# EAGLE design SMD (EAGLE 8.0.1)
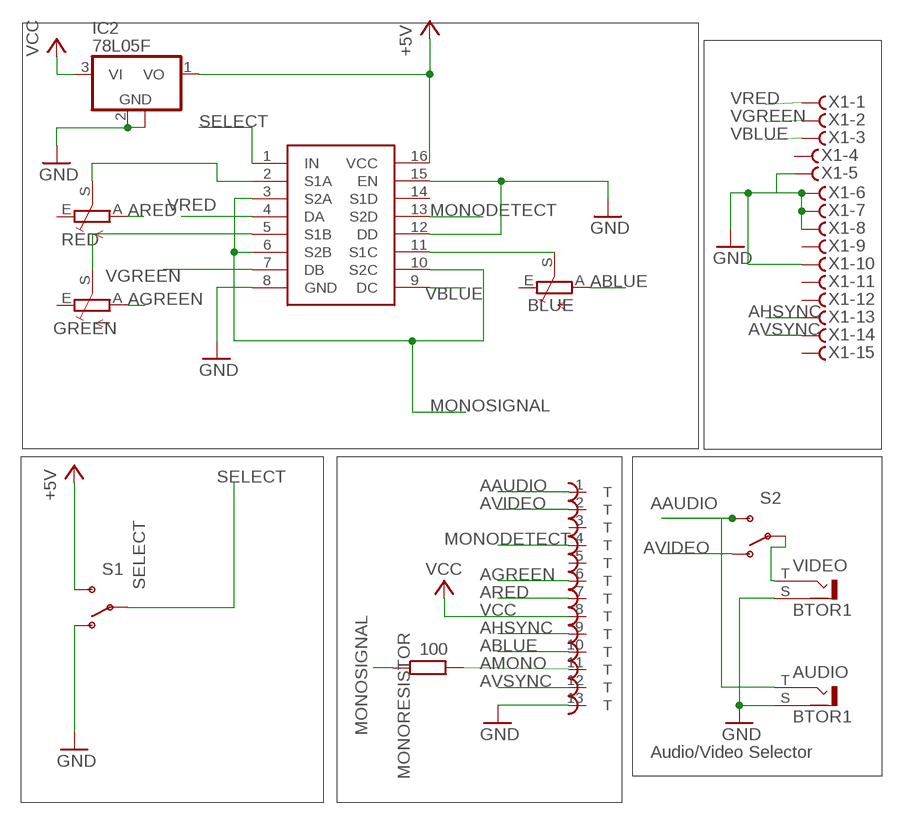
[diagram p0: schematic, sheet 1]

## Parts
ATARIOUT  DIN13T  [ADADS]
AUDIO  BTOR1  [BTOR1]
BLUE  TRIM_EU-CA6H  [CA6H]
GREEN  TRIM_EU-CA6H  [CA6H]
IC2  78L05F  [SOT89]
MONORESISTOR  100  R-EU_R1206  [R1206]
RED  TRIM_EU-CA6H  [CA6H]
S1  SWITCH-SPDT-SMD-A  [SWITCH-SPST-SMD-A]
S2  SWITCH-SPDT-SMD-A  [SWITCH-SPST-SMD-A]
TS5V330  V330  [SOIC16N]
VIDEO  BTOR1  [BTOR1]
X1  F15HDVS  [HDF15V]

## Nets
+5V: IC2.1(VO) S1.3(S) TS5V330.16(VCC)
A/V-PIN: S2.2(P) VIDEO.T
AAUDIO: ATARIOUT.1 AUDIO.T S2.3(S)
ABLUE: ATARIOUT.10 BLUE.A
AGREEN: ATARIOUT.6 GREEN.A
AHSYNC: ATARIOUT.9 X1.13
AMONO: ATARIOUT.11 MONORESISTOR.2
ARED: ATARIOUT.7 RED.A
AVIDEO: ATARIOUT.2 S2.1(O)
AVSYNC: ATARIOUT.12 X1.14
BOUT: BLUE.S TS5V330.11(S1C)
GND: ATARIOUT.13 AUDIO.S IC2.2(GND) IC2.2@1(GND) S1.1(O) TS5V330.8(GND) TS5V330.12(DD) TS5V330.15(EN) VIDEO.S X1.5 X1.6 X1.7 X1.8 X1.10
GOUT: GREEN.S TS5V330.5(S1B)
MONODETECT: ATARIOUT.4 TS5V330.13(S2D)
MONOSIGNAL: MONORESISTOR.1 TS5V330.3(S2A) TS5V330.6(S2B) TS5V330.10(S2C)
ROUT: RED.S TS5V330.2(S1A)
SELECT: S1.2(P) TS5V330.1(IN)
VBLUE: TS5V330.9(DC) X1.3
VCC: ATARIOUT.8 IC2.3(VI)
VGREEN: TS5V330.7(DB) X1.2
VRED: TS5V330.4(DA) X1.1
Unconnected: ATARIOUT.3 ATARIOUT.5 AUDIO.S@1 AUDIO.S@2 AUDIO.S@3 BLUE.E GREEN.E RED.E TS5V330.14(S1D) VIDEO.S@1 VIDEO.S@2 VIDEO.S@3 X1.4 X1.9 X1.11 X1.12 X1.15

## Notes on the sheet
- Audio/Video Selector

## Library data of the parts
ATARIOUT = ube:DIN13
AUDIO VIDEO = con-lumberg:BTOR1: RCA connectors according to JEITA RC-5231 Cinch RCA-Einbaukupplung nach JEITA RC-5231, stehende Ausführung Source: http://www.lumberg.de/Produkte/PDFs/BTOR1.pdf; OC_FARNELL: 1217030; OC_NEWARK: unknown
BLUE GREEN RED = pot:TRIM_EU-: POTENTIOMETER
IC2 = linear:78L*: POSITOIV-VOLTAGE REGULATORS Output up to 100 mA Source: Datasheet <http://focus.ti.com/lit/ds/symlink/ua78l05.pdf>
MONORESISTOR = rcl:R-EU_: RESISTOR, European symbol
S1 S2 = SparkFun-Electromechanical:SWITCH-SPDT: SPDT Switch Simple slide switch, Spark Fun Electronics SKU : COM-00102 DPDT SMT slide switch, AYZ0202, SWCH-08179; PROD_ID: SWCH-10651
TS5V330 = ube:V330
X1 = con-subd:F15?S: SUB-D; OC_FARNELL: unknown; OC_NEWARK: unknown

## Net classes
0 default: width 0.254 mm

## Board
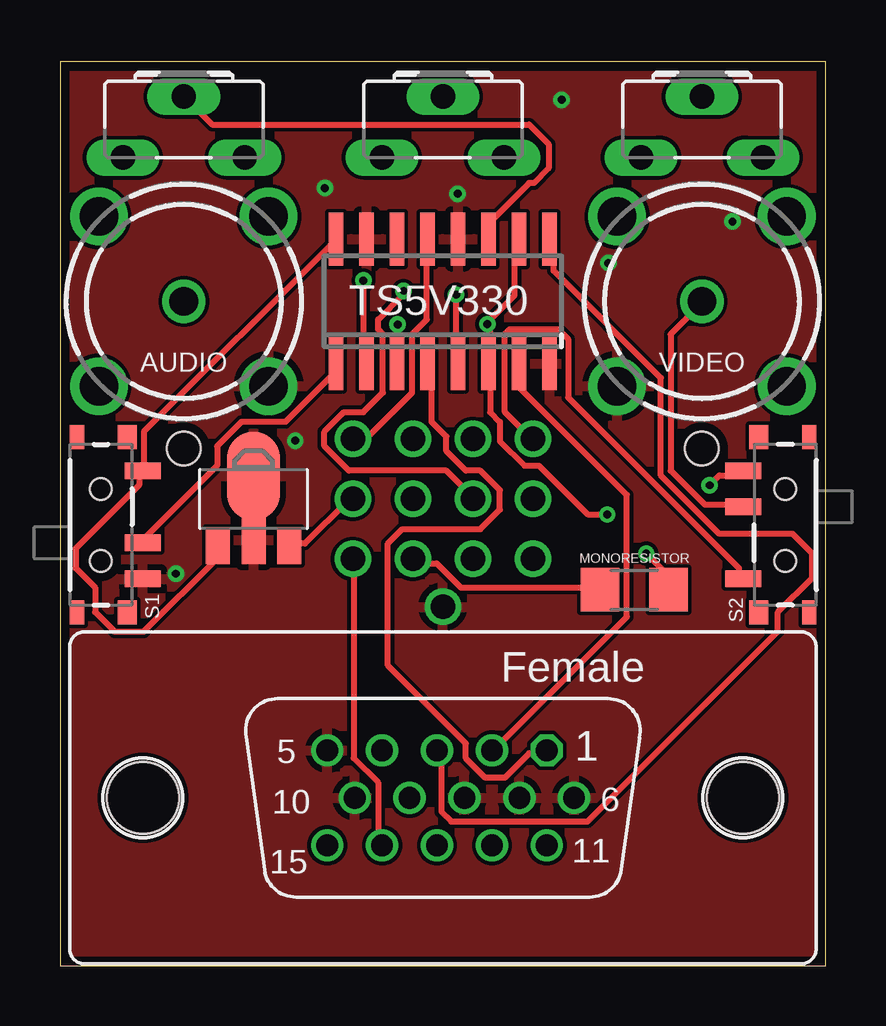
[diagram p1: board, top side]
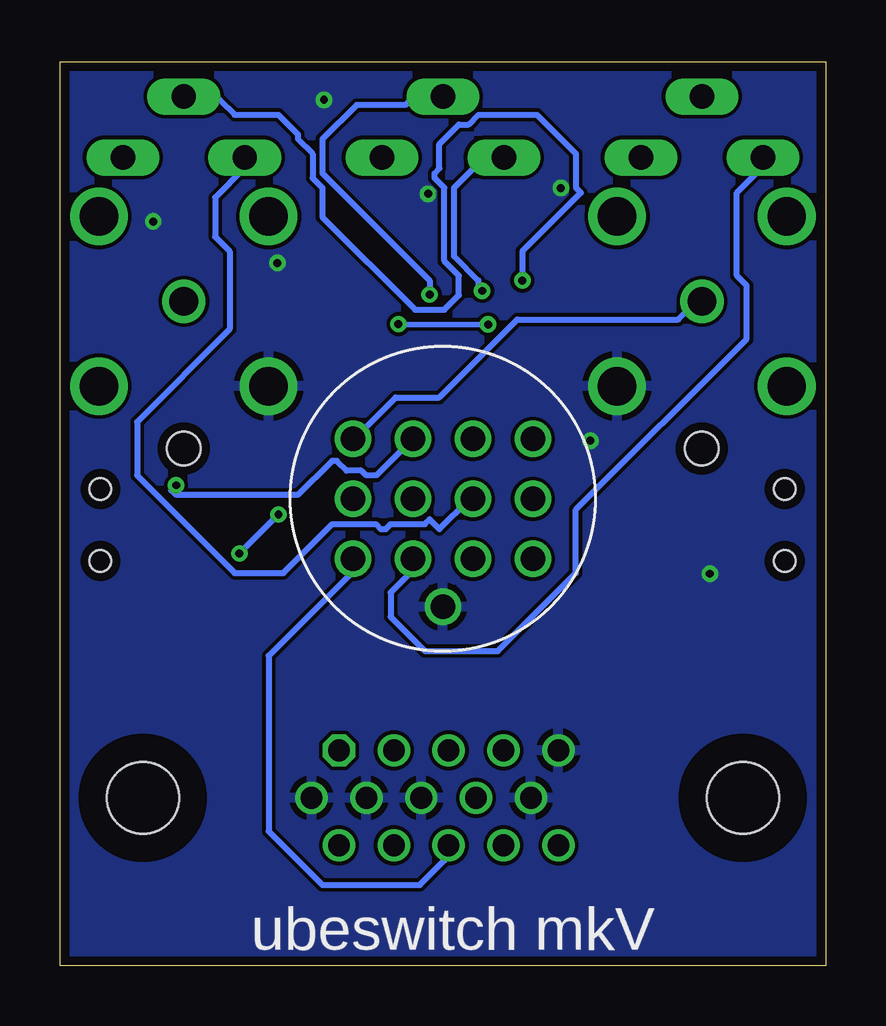
[diagram p2: board, bottom side, seen from below]

Size 31.9 x 37.7 mm. Coordinates in mm from the lower left corner, seen from the top.
Outline: 0,0 31.9,0 31.9,37.7 0,37.7 0,0
Copper layers (1*16): Top 0.0356mm / dielectric 1.5011mm / Bottom 0.0356mm
Design rules "PCBs_io": minimum track width 6mil, minimum drill 13mil, track to track 6mil, track to pad 6mil, pad to pad 6mil, via to via 6mil, smd to smd 6mil, copper to edge 15mil, drill to drill 6mil, minimum pad ring 7mil, minimum via ring 7mil, stop-mask expansion 3mil, vias tented up to drill 0mil, thermal gap 10mil
Holes 1.4 mm at 5.16,21.56 26.75,21.56

### Footprints (pad centres in the part's own frame; a part is rotated, then mirrored left to right if it is on the bottom)
ADADS = drill 1.016: 1 -3.75,2.5; 2 -1.25,2.5; 3 1.25,2.5; 4 3.75,2.5; 5 -3.75,0; 6 -1.25,0; 7 1.25,0; 8 3.75,0; 9 -3.75,-2.5; 10 -1.25,-2.5; 11 1.25,-2.5; 12 3.75,-2.5; 13 0,-4.5
BTOR1 = drill 1.6 pad 2.2: S -5,0; S@1 0,5; S@2 5,0; S@3 0,-5 | drill 1.2 pad 1.6: T 0,0
CA6H = drill 1.016 long: A -2.54,0; E 2.54,0; S 0,2.54
SOT89 = smd 1 x 1.5: 1 -1.499,-1.981; 3 1.499,-1.981 | smd 1 x 2: 2 0,-1.727 | smd 2.2 x 3.7: 2@1 0,0.94
R1206 = smd 1.6 x 1.803: 1 -1.422,0; 2 1.422,0
SWITCH-SPST-SMD-A = smd 0.7 x 1.5: 1 -2.25,-1.75; 2 -0.75,-1.75; 3 2.25,-1.75 | smd 1 x 0.6: GND1 -3.65,1; GND3 3.65,1 | smd 1 x 0.8: GND2 -3.65,-1.1; GND4 3.65,-1.1 | hole 0.9: -1.5,0; 1.5,0
SOIC16N = smd 0.6 x 2.2: 1 -4.445,-2.6; 2 -3.175,-2.6; 3 -1.905,-2.6; 4 -0.635,-2.6; 5 0.635,-2.6; 6 1.905,-2.6; 7 3.175,-2.6; 8 4.445,-2.6; 9 4.445,2.6; 10 3.175,2.6; 11 1.905,2.6; 12 0.635,2.6; 13 -0.635,2.6; 14 -1.905,2.6; 15 -3.175,2.6; 16 -4.445,2.6
HDF15V = drill 0.9 octagon: 1 4.329,1.98 | drill 0.9: 2 2.043,1.98; 3 -0.243,1.98; 4 -2.529,1.98; 5 -4.815,1.98; 6 5.472,0; 7 3.186,0; 8 0.9,0; 9 -1.386,0; 10 -3.672,0; 11 4.329,-1.98; 12 2.043,-1.98; 13 -0.243,-1.98; 14 -2.529,-1.98; 15 -4.815,-1.98 | hole 3: -12.5,0; 12.5,0

### Placement (x,y rotation side)
ATARIOUT  15.95,19.47 0 bottom
AUDIO  5.16,27.7 135 top
BLUE  5.16,33.7 0 top
GREEN  15.95,33.7 0 top
IC2  8.06,19.48 0 top
MONORESISTOR  23.93,15.68 180 top
RED  26.75,33.7 0 top
S1  1.71,18.38 90 top
S2  30.22,18.38 270 top
TS5V330  15.95,27.7 0 top
VIDEO  26.75,27.7 45 top
X1  15.95,7 0 top

### Tracks (layer width: path | path; a pad name or v marks a point on that pad's centre or on a via)
+5V
  Top 0.254: TS5V330.16 11.42,30.2 3.5,22.27 3.5,20.65 S1.3 3.29,20.44 3.29,20.04 0.65,17.39 0.65,16.58 1.47,15.77 1.47,14.75 2.28,13.94 3.5,13.94 6.55,16.99 6.55,17.39 IC2.1
A/V-PIN
  Top 0.254: S2.2 28.29,19.22 26.87,19.22 25.44,20.65 25.44,26.34 26.66,27.55 VIDEO.T
AAUDIO
  Top 0.254: S2.3 28.29,16.18 28.29,16.58 21.18,23.69 21.18,26.13 20.77,26.54 18.74,26.54 18.53,26.34 18.53,23.08 19.55,22.07 ATARIOUT.1
  Bottom 0.254: AUDIO.T 5.33,27.55 5.53,27.55 6.14,26.95 12.85,26.95 16.1,23.69 17.93,23.69 19.55,22.07 ATARIOUT.1
ABLUE
  Bottom 0.254: BLUE.A 2.69,33.65 2.69,33.24 3.7,32.23 3.7,28.77 3.29,28.37 3.29,26.13 10.41,19.02 10.41,16.38 13.66,13.13 16.71,13.13 18.13,14.55 18.13,15.57 17.32,16.38 17.32,16.79 ATARIOUT.10
AGREEN  (via drill 0.33)
  Top 0.254: ATARIOUT.6 17.11,19.63 16.1,20.65 12.03,20.65 11.02,21.66 11.02,22.27 11.83,23.08 12.64,23.08 13.45,23.9 13.45,26.34 13.25,26.54 13.25,26.95 14.27,27.96 v14.32,28.14
  Bottom 0.254: GREEN.A 13.45,33.65 14.27,33.65 15.49,32.43 15.49,29.59 14.47,28.57 14.47,28.16 v14.32,28.14
AHSYNC
  Bottom 0.254: X1.13 15.89,5 15.89,4.39 16.91,3.37 20.97,3.37 23.21,5.61 23.21,12.92 19.75,16.38 19.75,16.79 ATARIOUT.9
AMONO
  Top 0.254: MONORESISTOR.2 22.4,15.77 16.71,15.77 15.69,16.79 14.88,16.79 ATARIOUT.11
ARED
  Bottom 0.254: ATARIOUT.7 14.88,19.43 16.1,18.21 16.5,18.61 16.71,18.41 18.13,18.41 18.33,18.21 18.53,18.21 18.74,18.41 20.57,18.41 22.6,16.38 24.63,16.38 28.69,20.44 28.69,22.68 24.83,26.54 24.83,29.79 25.44,30.4 25.44,32.03 24.22,33.24 24.22,33.65 RED.A
AVIDEO  (via drill 0.33)
  Top 0.254: v27.07,20.04 27.48,20.44 28.29,20.44 S2.1
  Bottom 0.254: v27.07,20.04 27.27,19.83 27.07,19.63 21.99,19.63 20.57,21.05 20.36,21.05 19.96,20.65 19.35,20.65 19.14,20.44 18.74,20.44 17.32,21.86 ATARIOUT.2
AVSYNC
  Top 0.254: X1.14 13.25,5.2 13.25,7.64 12.24,8.66 12.24,16.79 ATARIOUT.12
BOUT
  Top 0.254: TS5V330.11 17.93,30.4 17.93,31.01 19.55,32.63 19.75,32.63 20.36,33.24 20.36,34.26 19.55,35.07 6.34,35.07 5.33,36.09 BLUE.S
GND  (via drill 0.33)
  Top 0.254: IC2.2@1 8.17,20.24 8.17,20.21
  Bottom 0.254: 23.82,24.71 VIDEO.S
  other vias: 4.83,16.35 16.56,32.18 11.03,32.43 9.8,21.89 28.02,31.03 22.85,29.3 20.9,36.1
  pour Bottom: 0.3,39.34 32.05,39.34 32.05,-0.03 0.3,-0.03
  pour Top: 0.3,-0.03 0.3,38.07 32.05,38.07 32.05,-0.03
GOUT  (via drill 0.33)
  Top 0.254: v16.5,27.98 16.5,25.12 TS5V330.5
  Bottom 0.254: GREEN.S 16.1,36.09 17.32,36.09 17.52,35.89 19.55,35.89 20.97,34.46 20.97,33.04 16.5,28.57 v16.5,27.98
MONODETECT
  Top 0.254: TS5V330.13 15.28,30.2 15.28,26.95 14.67,26.34 14.67,23.9 12.85,22.07 12.24,22.07 ATARIOUT.4
MONOSIGNAL  (via drill 0.33)
  Top 0.254: v24.43,17.19 25.24,16.38 25.24,15.77 MONORESISTOR.1 | v22.8,18.82 21.99,18.82 19.96,20.85 19.35,20.85 18.33,21.86 18.33,22.68 17.93,23.08 17.93,24.91 TS5V330.6 | v14.06,26.74 14.06,25.12 TS5V330.3 | 17.72,25.12 TS5V330.6 | TS5V330.10 18.94,30.2 18.94,27.96 17.93,26.95 v17.81,26.75 17.93,26.74 17.93,25.12 TS5V330.6
  Bottom 0.254: v22.8,18.82 v24.43,17.19 | v17.81,26.75 v14.06,26.74
ROUT  (via drill 0.33)
  Top 0.254: v12.64,28.57 12.64,25.12 TS5V330.2
  Bottom 0.254: v12.64,28.57 12.64,29.79 10.2,32.23 10.41,32.43 10.41,33.85 12.03,35.48 14.47,35.48 14.88,35.07 15.28,35.07 16.1,34.26 16.1,33.24 16.3,33.04 16.3,32.84 15.89,32.43 15.89,29.38 15.28,28.77 15.28,27.96 15.89,27.35 17.11,27.35 20.97,31.21 20.97,32.43 21.38,32.84 21.38,33.85 21.99,34.46 21.99,34.67 22.8,35.48 24.63,35.48 25.24,36.09 26.66,36.09 RED.S
SELECT
  Top 0.254: S1.2 3.5,17.8 6.55,20.85 6.55,21.66 7.56,22.68 9.39,22.68 11.63,24.91 TS5V330.1
VBLUE
  Top 0.254: TS5V330.9 20.57,30.2 20.57,28.98 25.04,24.51 25.04,20.44 27.48,18 30.52,18 31.34,17.19 31.34,16.18 29.91,14.75 29.91,13.94 21.99,6.02 16.3,6.02 15.89,6.42 15.89,8.86 X1.3
VCC
  Top 0.254: IC2.3 9.59,17.6 10.2,17.6 12.03,19.43 ATARIOUT.8
VGREEN
  Top 0.254: TS5V330.7 19.14,24.91 19.14,24.1 23.61,19.63 23.61,14.55 18.13,9.06 X1.2
VRED
  Top 0.254: TS5V330.4 15.49,24.91 15.49,22.68 16.1,22.07 16.1,21.46 16.91,20.65 17.52,20.65 18.33,19.83 18.33,19.02 17.52,18.21 14.27,18.21 13.66,17.6 13.66,12.52 16.91,9.27 16.91,8.66 17.72,7.84 18.53,7.84 19.55,8.86 20.16,8.86 X1.1

### Text on the board
bNames: ubeswitch mkV
Document: Distance from PCB to surface. | Distance from PIN13 to bottom of case. | Distance from PIN13 to surface.